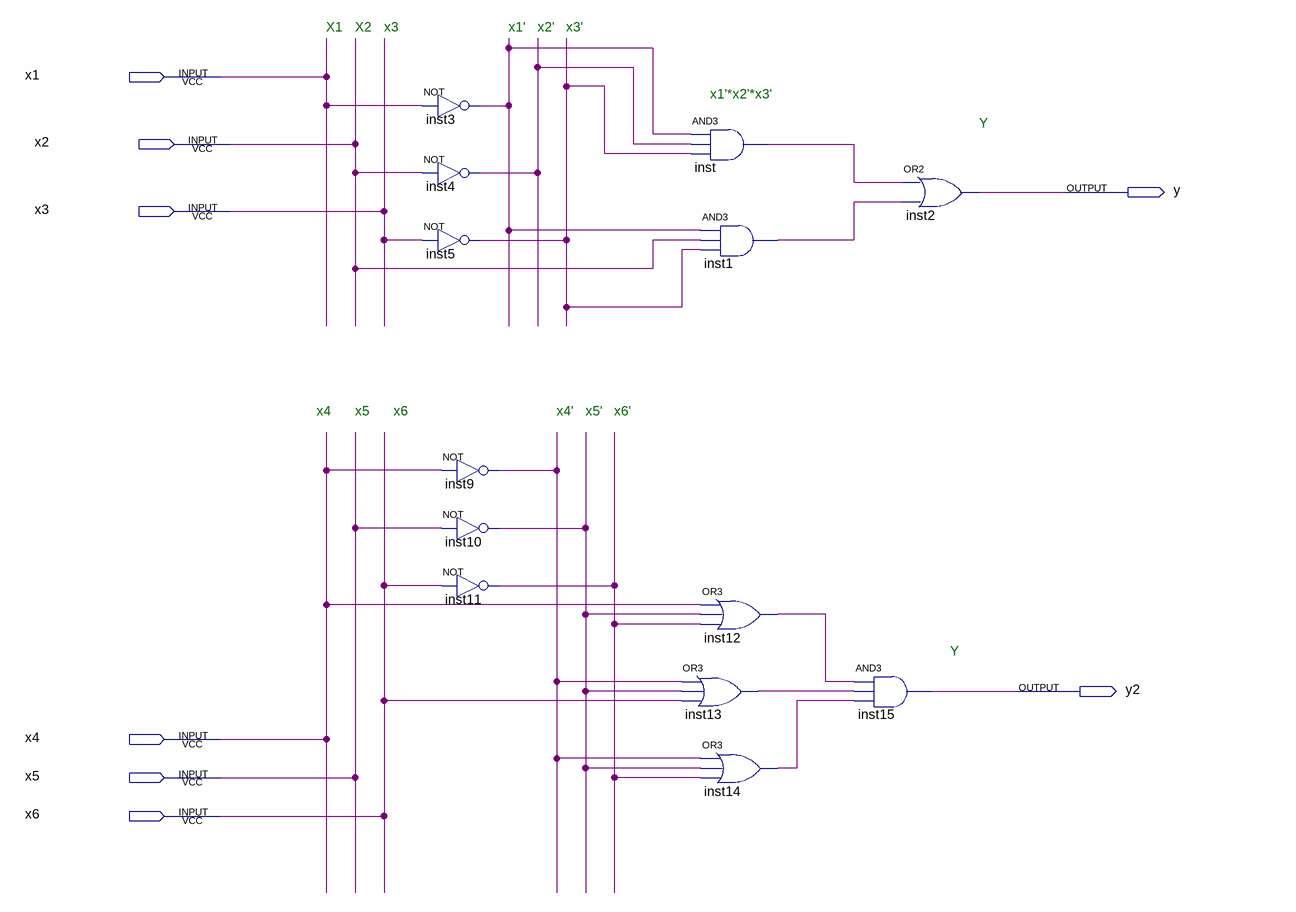
[diagram p0: schematic sheet]
// Quartus schematic functions.bdf as structural Verilog: 13 symbols, 8 pins
module functions (
  input  x1,
  input  x2,
  input  x3,
  input  x4,
  input  x5,
  input  x6,
  output y,
  output y2
);

  wire inst1_out, inst3_out, inst4_out, inst5_out, inst9_out, inst10_out, inst11_out, inst12_out, inst13_out,
       inst14_out, inst_out;

  not inst3 (inst3_out, x1);
  not inst4 (inst4_out, x2);
  not inst5 (inst5_out, x3);
  not inst9 (inst9_out, x4);
  not inst10 (inst10_out, x5);
  not inst11 (inst11_out, x6);
  and inst (inst_out, inst3_out, inst4_out, inst5_out);
  and inst1 (inst1_out, inst3_out, x2, inst5_out);
  or inst12 (inst12_out, x4, inst10_out, inst11_out);
  or inst13 (inst13_out, inst9_out, inst10_out, x6);
  or inst14 (inst14_out, inst9_out, inst10_out, inst11_out);
  or inst2 (y, inst_out, inst1_out);
  and inst15 (y2, inst12_out, inst13_out, inst14_out);

  // Notes on the sheet:
  //   X1
  //   X2
  //   x3
  //   x1'
  //   x2'
  //   x3'
  //   x1'*x2'*x3'
  //   Y
  //   x4
  //   x5
  //   x6
  //   x4'
  //   x5'
  //   x6'
  //   Y
endmodule
